# Altium schematic sheet SD_Card.SchDoc: SD Card
size Tabloid; Date: 05/10/2023; Engineer: Terry D. Schevker; Revision: 1.0; SheetNumber: 1; SheetTotal: 3
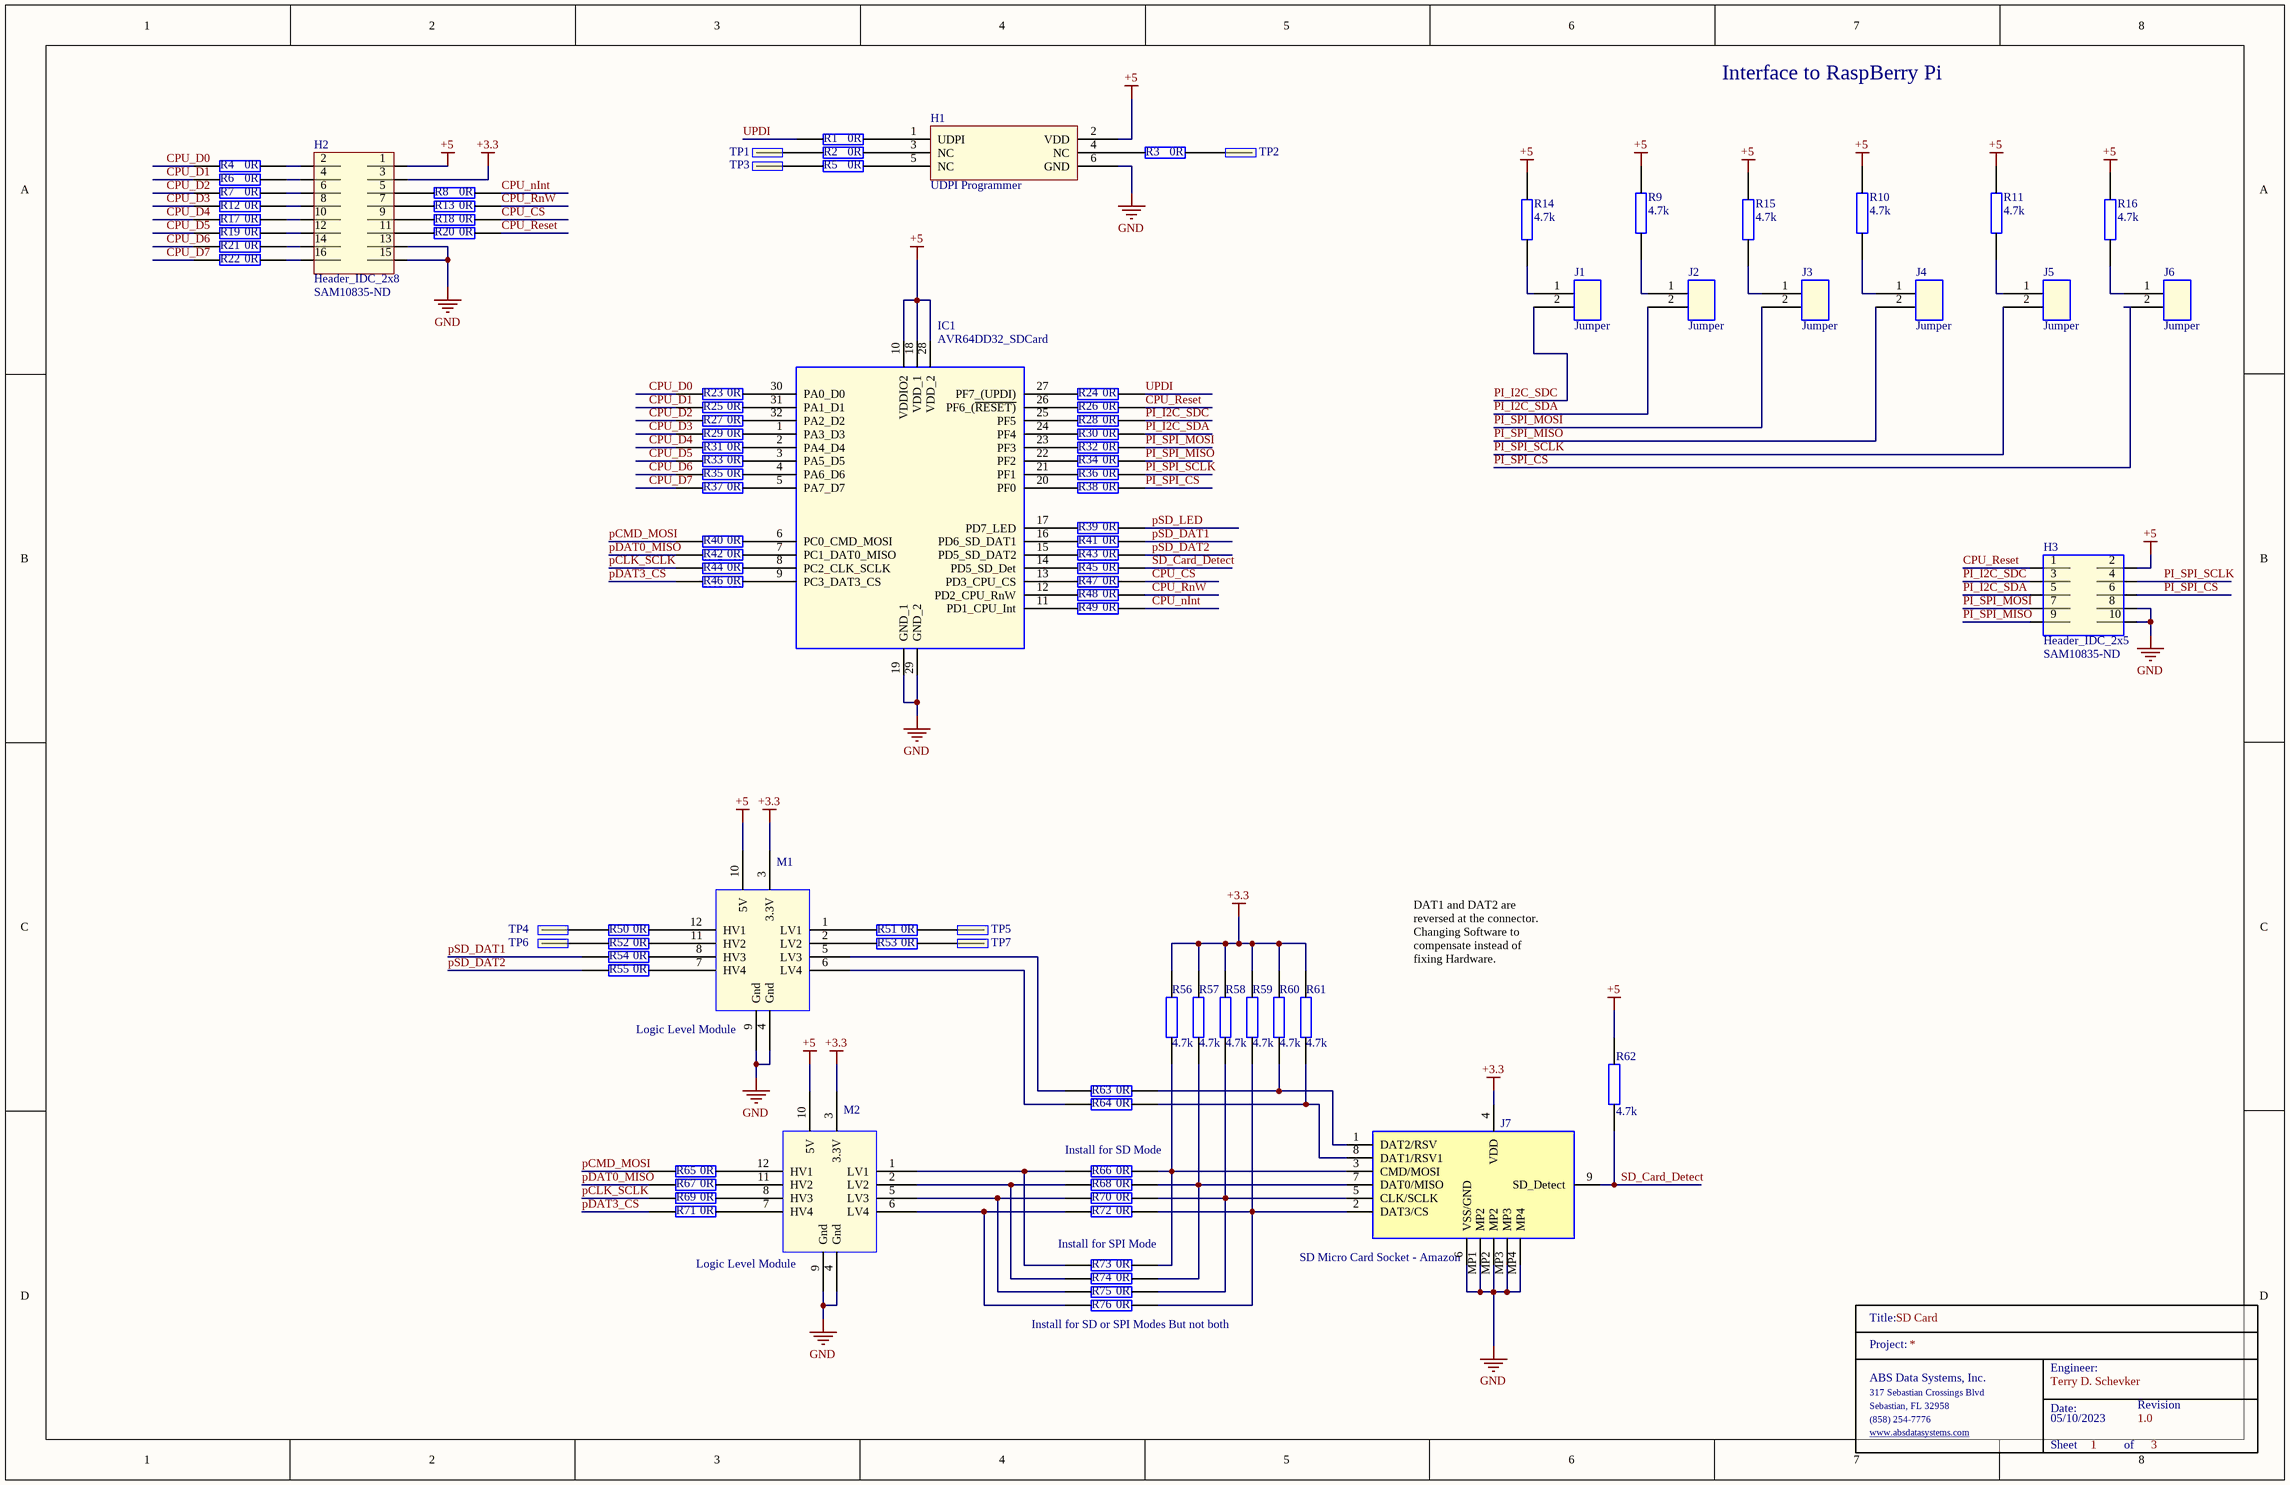
[diagram p0: SD_Card.SchDoc]

## Parts
H1  UDPI Programmer  [HDR2X3]
H2  Header_IDC_2x8  Supplier Part Number 1: SAM10835-ND  [HEADER16]
H3  Header_IDC_2x5  Supplier Part Number 1: SAM10835-ND  [HDR2X5]
IC1  AVR64DD32_SDCard  [QFP80P900X900X120-32N]
J1  Jumper  [Jumper]
J2  Jumper  [Jumper]
J3  Jumper  [Jumper]
J4  Jumper  [Jumper]
J5  Jumper  [Jumper]
J6  Jumper  [Jumper]
J7  SD Micro Card Socket - Amazon  [SDMicroConnector]
M1  Logic Level Module  [Logic_Level_Module]
M2  Logic Level Module  [Logic_Level_Module]
R1  0R  [0603]
R2  0R  [0603]
R3  0R  [0603]
R4  0R  [0603]
R5  0R  [0603]
R6  0R  [0603]
R7  0R  [0603]
R8  0R  [0603]
R9  4.7k  [0603]
R10  4.7k  [0603]
R11  4.7k  [0603]
R12  0R  [0603]
R13  0R  [0603]
R14  4.7k  [0603]
R15  4.7k  [0603]
R16  4.7k  [0603]
R17  0R  [0603]
R18  0R  [0603]
R19  0R  [0603]
R20  0R  [0603]
R21  0R  [0603]
R22  0R  [0603]
R23  0R  [0603]
R24  0R  [0603]
R25  0R  [0603]
R26  0R  [0603]
R27  0R  [0603]
R28  0R  [0603]
R29  0R  [0603]
R30  0R  [0603]
R31  0R  [0603]
R32  0R  [0603]
R33  0R  [0603]
R34  0R  [0603]
R35  0R  [0603]
R36  0R  [0603]
R37  0R  [0603]
R38  0R  [0603]
R39  0R  [0603]
R40  0R  [0603]
R41  0R  [0603]
R42  0R  [0603]
R43  0R  [0603]
R44  0R  [0603]
R45  0R  [0603]
R46  0R  [0603]
R47  0R  [0603]
R48  0R  [0603]
R49  0R  [0603]
R50  0R  [0603]
R51  0R  [0603]
R52  0R  [0603]
R53  0R  [0603]
R54  0R  [0603]
R55  0R  [0603]
R56  4.7k  [0603]
R57  4.7k  [0603]
R58  4.7k  [0603]
R59  4.7k  [0603]
R60  4.7k  [0603]
R61  4.7k  [0603]
R62  4.7k  [0603]
R63  0R  [0603]
R64  0R  [0603]
R65  0R  [0603]
R66  0R  [0603]
R67  0R  [0603]
R68  0R  [0603]
R69  0R  [0603]
R70  0R  [0603]
R71  0R  [0603]
R72  0R  [0603]
R73  0R  [0603]
R74  0R  [0603]
R75  0R  [0603]
R76  0R  [0603]
TitleBlock_1  TitleBlock  (value not drawn)  (graphical)
TP1  TP  [TP]  (value not drawn)
TP2  TP  [TP]  (value not drawn)
TP3  TP  [TP]  (value not drawn)
TP4  TP  [TP]  (value not drawn)
TP5  TP  [TP]  (value not drawn)
TP6  TP  [TP]  (value not drawn)
TP7  TP  [TP]  (value not drawn)

## Nets
+3.3: H2.3 J7.4(VDD) M1.3(3.3V) M2.3(3.3V) R56.2 R57.2 R58.2 R59.2 R60.2 R61.2
+5: H1.2(VDD) H2.1 H3.2 IC1.10(VDDIO2) IC1.18(VDD_1) IC1.28(VDD_2) M1.10(5V) M2.10(5V) R9.2 R10.2 R11.2 R14.2 R15.2 R16.1 R62.2
GND: H1.6(GND) H2.13 H2.15 H3.8 H3.10 IC1.19(GND_1) IC1.29(GND_2) J7.6(VSS/GND) J7.MP1(MP2) J7.MP2 J7.MP3 J7.MP4 M1.4(Gnd) M1.9(Gnd) M2.4(Gnd) M2.9(Gnd)
CPU_CS: R18.2 R47.2
CPU_D0: R4.1 R23.1
CPU_D1: R6.1 R25.1
CPU_D2: R7.1 R27.1
CPU_D3: R12.1 R29.1
CPU_D4: R17.1 R31.1
CPU_D5: R19.1 R33.1
CPU_D6: R21.1 R35.1
CPU_D7: R22.1 R37.1
CPU_nInt: R8.2 R49.2
CPU_Reset: H3.1 R20.2 R26.2
CPU_RnW: R13.2 R48.2
pCLK_SCLK: R44.1 R69.1
pCMD_MOSI: R40.1 R65.1
pDAT0_MISO: R42.1 R67.1
pDAT3_CS: R46.1 R71.1
PI_I2C_SDA: H3.5 J2.2 R30.2
PI_I2C_SDC: H3.3 J1.2 R28.2
PI_SPI_CS: H3.6 J6.2 R38.2
PI_SPI_MISO: H3.9 J4.2 R34.2
PI_SPI_MOSI: H3.7 J3.2 R32.2
PI_SPI_SCLK: H3.4 J5.2 R36.2
pSD_DAT1: R41.2 R54.1
pSD_DAT2: R43.2 R55.1
pSD_LED: R39.2
SD_Card_Detect: J7.9(SD_Detect) R45.2 R62.1
UPDI: R1.1 R24.2
NetH1_1: H1.1(UDPI) R1.2
NetH1_3: H1.3(NC) R2.2
NetH1_4: H1.4(NC) R3.1
NetH1_5: H1.5(NC) R5.2
NetH2_2: H2.2 R4.2
NetH2_4: H2.4 R6.2
NetH2_5: H2.5 R8.1
NetH2_6: H2.6 R7.2
NetH2_7: H2.7 R13.1
NetH2_8: H2.8 R12.2
NetH2_9: H2.9 R18.1
NetH2_10: H2.10 R17.2
NetH2_11: H2.11 R20.1
NetH2_12: H2.12 R19.2
NetH2_14: H2.14 R21.2
NetH2_16: H2.16 R22.2
NetIC1_1: IC1.1(PA3_D3) R29.2
NetIC1_2: IC1.2(PA4_D4) R31.2
NetIC1_3: IC1.3(PA5_D5) R33.2
NetIC1_4: IC1.4(PA6_D6) R35.2
NetIC1_5: IC1.5(PA7_D7) R37.2
NetIC1_6: IC1.6(PC0_CMD_MOSI) R40.2
NetIC1_7: IC1.7(PC1_DAT0_MISO) R42.2
NetIC1_8: IC1.8(PC2_CLK_SCLK) R44.2
NetIC1_9: IC1.9(PC3_DAT3_CS) R46.2
NetIC1_11: IC1.11(PD1_CPU_Int) R49.1
NetIC1_12: IC1.12(PD2_CPU_RnW) R48.1
NetIC1_13: IC1.13(PD3_CPU_CS) R47.1
NetIC1_14: IC1.14(PD5_SD_Det) R45.1
NetIC1_15: IC1.15(PD5_SD_DAT2) R43.1
NetIC1_16: IC1.16(PD6_SD_DAT1) R41.1
NetIC1_17: IC1.17(PD7_LED) R39.1
NetIC1_20: IC1.20(PF0) R38.1
NetIC1_21: IC1.21(PF1) R36.1
NetIC1_22: IC1.22(PF2) R34.1
NetIC1_23: IC1.23(PF3) R32.1
NetIC1_24: IC1.24(PF4) R30.1
NetIC1_25: IC1.25(PF5) R28.1
NetIC1_26: IC1.26(PF6_(~{RESET)}) R26.1
NetIC1_27: IC1.27(PF7_(UPDI)) R24.1
NetIC1_30: IC1.30(PA0_D0) R23.2
NetIC1_31: IC1.31(PA1_D1) R25.2
NetIC1_32: IC1.32(PA2_D2) R27.2
NetJ1_1: J1.1 R14.1
NetJ2_1: J2.1 R9.1
NetJ3_1: J3.1 R15.1
NetJ4_1: J4.1 R10.1
NetJ5_1: J5.1 R11.1
NetJ6_1: J6.1 R16.2
NetJ7_1: J7.1(DAT2/RSV) R60.1 R63.2
NetJ7_2: J7.2(DAT3/CS) R59.1 R72.2 R76.2
NetJ7_3: J7.3(CMD/MOSI) R56.1 R66.2 R73.2
NetJ7_5: J7.5(CLK/SCLK) R58.1 R70.2 R75.2
NetJ7_7: J7.7(DAT0/MISO) R57.1 R68.2 R74.2
NetJ7_8: J7.8(DAT1/RSV1) R61.1 R64.2
NetM1_1: M1.1(LV1) R51.1
NetM1_2: M1.2(LV2) R53.1
NetM1_5: M1.5(LV3) R63.1
NetM1_6: M1.6(LV4) R64.1
NetM1_7: M1.7(HV4) R55.2
NetM1_8: M1.8(HV3) R54.2
NetM1_11: M1.11(HV2) R52.2
NetM1_12: M1.12(HV1) R50.2
NetM2_1: M2.1(LV1) R66.1 R73.1
NetM2_2: M2.2(LV2) R68.1 R74.1
NetM2_5: M2.5(LV3) R70.1 R75.1
NetM2_6: M2.6(LV4) R72.1 R76.1
NetM2_7: M2.7(HV4) R71.2
NetM2_8: M2.8(HV3) R69.2
NetM2_11: M2.11(HV2) R67.2
NetM2_12: M2.12(HV1) R65.2
NetR2_1: R2.1 TP1.1
NetR3_2: R3.2 TP2.1
NetR5_1: R5.1 TP3.1
NetR50_1: R50.1 TP4.1
NetR51_2: R51.2 TP5.1
NetR52_1: R52.1 TP6.1
NetR53_2: R53.2 TP7.1

## Notes on the sheet
- Interface to RaspBerry Pi
- sei();
- DAT1 and DAT2 are reversed at the connector. Changing Software to compensate instead of fixing Hardware.
- (near R66) Install for SD Mode
- (near R73) Install for SPI Mode
- (near R76) Install for SD or SPI Modes But not both
- (in symbol TitleBlock) Title:; Project:; Engineer:; ABS Data Systems, Inc.; 317 Sebastian Crossings Blvd; Sebastian, FL 32958; Date:; Revision; (858) 254-7776; www.absdatasystems.com; Sheet; of

## Library data of the parts
H1 = UDPI Programmer: 6 Pin 2X3 Through Hole Header
H2 = Header_IDC_2x8: 16 Pin 2x8 Through Hold IDC Connector; Manufacturer: Samtec; Manufacturer Part Number: TST-108-01-G-D; Number of Contacts: 16; Gender: Male; Connector Type: Male Pin; Pitch: 2.54mm; Row Spacing: 0.1inch; Supplier 1: Digi-Key; RoHS: Yes; Category: Headers and Wire Housings; Stock 1: 227; Pricing 1: 1=2.85000, 10=2.73600, 100=2.28000, 500=1.93800, 1000=1.65300, 5000=1.48200 (USD); Mount: Through Hole; Contact Plating: Gold; Contact Material: Bronze; Housing Material: Polyester; Housing Color: Black; Color: Black; Min Operating Temperature: -55°C; Max Operating Temperature: 125°C; Number of Rows: 2; Termination: Solder; Packaging: Rail/Tube; Orientation: Straight; Number of Positions: 16; Length: 27.94mm; Depth: 9.27mm; Contact Mating Length: 0.25inch; REACH SVHC: No SVHC; ComponentLink1URL: https://datasheet.ciiva.com/739/tst-mkt-739845.pdf?src-supplier=Digi-Key; ComponentLink1Description: https://datasheet.ciiva.com/739/tst-mkt-739845.pdf?src-supplier=Digi-Key; ComponentLink2URL: https://datasheet.ciiva.com/10018/htst-10018510.pdf?src-supplier=Avnet; ComponentLink2Description: https://datasheet.ciiva.com/10018/htst-10018510.pdf?src-supplier=Avnet
H3 = Header_IDC_2x5: 10 Pin 2x5 Through Hold IDC Connector; Manufacturer: Samtec; Manufacturer Part Number: TST-105-01-G-D; Number of Contacts: 16; Gender: Male; Connector Type: Male Pin; Pitch: 2.54mm; Row Spacing: 0.1inch; Supplier 1: Digi-Key; RoHS: Yes; Category: Headers and Wire Housings; Stock 1: 227; Pricing 1: 1=2.85000, 10=2.73600, 100=2.28000, 500=1.93800, 1000=1.65300, 5000=1.48200 (USD); Mount: Through Hole; Contact Plating: Gold; Contact Material: Bronze; Housing Material: Polyester; Housing Color: Black; Color: Black; Min Operating Temperature: -55°C; Max Operating Temperature: 125°C; Number of Rows: 2; Termination: Solder; Packaging: Rail/Tube; Orientation: Straight; Number of Positions: 16; Length: 27.94mm; Depth: 9.27mm; Contact Mating Length: 0.25inch; REACH SVHC: No SVHC; ComponentLink1URL: https://datasheet.ciiva.com/739/tst-mkt-739845.pdf?src-supplier=Digi-Key; ComponentLink1Description: https://datasheet.ciiva.com/739/tst-mkt-739845.pdf?src-supplier=Digi-Key; ComponentLink2URL: https://datasheet.ciiva.com/10018/htst-10018510.pdf?src-supplier=Avnet; ComponentLink2Description: https://datasheet.ciiva.com/10018/htst-10018510.pdf?src-supplier=Avnet
IC1 = AVR64DD32_SDCard: Integrated Circuit; Manufacturer_Name: Microchip; Manufacturer_Part_Number: AVR64DD32-I/PT | MULTI-VOLTAGE I/O; Datasheet Link: https://www.microchip.com/en-us/product/AVR64DD32; Height: 1.2mm
J1-J6 = Jumper: 16 Pin 3x8 Through Hold Jumprts; Manufacturer: Samtec; Manufacturer Part Number: TST-108-01-G-D; Number of Contacts: 16; Gender: Male; Connector Type: Male Pin; Pitch: 2.54mm; Row Spacing: 0.1inch; Supplier 1: Digi-Key; RoHS: Yes; Category: Headers and Wire Housings; Stock 1: 227; Pricing 1: 1=2.85000, 10=2.73600, 100=2.28000, 500=1.93800, 1000=1.65300, 5000=1.48200 (USD); Mount: Through Hole; Contact Plating: Gold; Contact Material: Bronze; Housing Material: Polyester; Housing Color: Black; Color: Black; Min Operating Temperature: -55°C; Max Operating Temperature: 125°C; Number of Rows: 2; Termination: Solder; Packaging: Rail/Tube; Orientation: Straight; Number of Positions: 16; Length: 27.94mm; Depth: 9.27mm; Contact Mating Length: 0.25inch; REACH SVHC: No SVHC; ComponentLink1URL: https://datasheet.ciiva.com/739/tst-mkt-739845.pdf?src-supplier=Digi-Key; ComponentLink1Description: https://datasheet.ciiva.com/739/tst-mkt-739845.pdf?src-supplier=Digi-Key; ComponentLink2URL: https://datasheet.ciiva.com/10018/htst-10018510.pdf?src-supplier=Avnet; ComponentLink2Description: https://datasheet.ciiva.com/10018/htst-10018510.pdf?src-supplier=Avnet
J7 = SD_Micro_Socket: Memory Card Connectors 9P R/A SMT MICRO SD HINGE PUSH-PULL; Manufacturer_Name: Hirose; Manufacturer_Part_Number: DM3CS-SF; Geometry.Height: 1.83mm; Mouser Part Number: 798-DM3CSSF; Mouser Price/Stock: https://www.mouser.co.uk/ProductDetail/Hirose-Connector/DM3CS-SF?qs=tTj%252BmQ3KZwbB9K5zh89Rcw%3D%3D; Datasheet Link: https://datasheet.lcsc.com/szlcsc/Hirose-HRS-DM3CS-SF_C202111.pdf
M1 M2 = Logic_Level_Module: Logic Level Converter Module
R1-R8 R12 R13 R17-R55 R63-R76 = RC0603JR-070RL: YAGEO 0603 0 ohm; Manufacturer_Name: KEMET; Geometry.Height: 0.55mm; Mouser Part Number: 603-RC0603JR-070RL; Mouser Price/Stock: https://www.mouser.co.uk/ProductDetail/YAGEO/RC0603JR-070RL?qs=2cAdsCoAWRGWyPcuXgGiXQ%3D%3D; Manufacturer_Part_Number: RC0603JR-070RL; Datasheet Link: https://datasheet.datasheetarchive.com/originals/distributors/Datasheets_SAMA/902f9e387b938f871d31120f5fc1d65e.pdf
R9-R11 R14-R16 R56-R62 = RC0603FR-104K7L: YAGEO 0603 4.7k; Manufacturer_Name: KEMET; Manufacturer_Part_Number: RC0603JR-070RL; Geometry.Height: 0.55mm; Mouser Part Number: 603-RC0603JR-070RL; Mouser Price/Stock: https://www.mouser.co.uk/ProductDetail/YAGEO/RC0603JR-070RL?qs=2cAdsCoAWRGWyPcuXgGiXQ%3D%3D; Datasheet Link: https://datasheet.datasheetarchive.com/originals/distributors/Datasheets_SAMA/902f9e387b938f871d31120f5fc1d65e.pdf
TP1-TP7 = TP: Manufacturer: Samtec; Manufacturer Part Number: TST-105-01-G-D; Number of Contacts: 16; Gender: Male; Connector Type: Male Pin; Pitch: 2.54mm; Row Spacing: 0.1inch; Supplier 1: Digi-Key; RoHS: Yes; Category: Headers and Wire Housings; Stock 1: 227; Pricing 1: 1=2.85000, 10=2.73600, 100=2.28000, 500=1.93800, 1000=1.65300, 5000=1.48200 (USD); Mount: Through Hole; Contact Plating: Gold; Contact Material: Bronze; Housing Material: Polyester; Housing Color: Black; Color: Black; Min Operating Temperature: -55°C; Max Operating Temperature: 125°C; Number of Rows: 2; Termination: Solder; Packaging: Rail/Tube; Orientation: Straight; Number of Positions: 16; Length: 27.94mm; Depth: 9.27mm; Contact Mating Length: 0.25inch; REACH SVHC: No SVHC; ComponentLink1URL: https://datasheet.ciiva.com/739/tst-mkt-739845.pdf?src-supplier=Digi-Key; ComponentLink1Description: https://datasheet.ciiva.com/739/tst-mkt-739845.pdf?src-supplier=Digi-Key; ComponentLink2URL: https://datasheet.ciiva.com/10018/htst-10018510.pdf?src-supplier=Avnet; ComponentLink2Description: https://datasheet.ciiva.com/10018/htst-10018510.pdf?src-supplier=Avnet